# EAGLE design SOIC-24 (EAGLE 5.00)
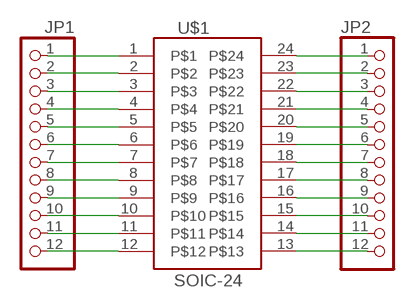
[diagram p0: schematic, sheet 1]

## Parts
JP1  PINHD-1X12  [1X12]
JP2  PINHD-1X12  [1X12]
U$1  SOIC-24  [SOIC-24]

## Nets
N$1: JP1.1 U$1.1
N$2: JP1.2 U$1.2
N$3: JP1.3 U$1.3
N$4: JP1.4 U$1.4
N$5: JP1.5 U$1.5
N$6: JP1.6 U$1.6
N$7: JP1.7 U$1.7
N$8: JP1.8 U$1.8
N$9: JP1.9 U$1.9
N$10: JP1.10 U$1.10
N$11: JP1.11 U$1.11
N$12: JP1.12 U$1.12
N$13: JP2.1 U$1.24
N$14: JP2.2 U$1.23
N$15: JP2.3 U$1.22
N$16: JP2.4 U$1.21
N$17: JP2.5 U$1.20
N$18: JP2.6 U$1.19
N$19: JP2.7 U$1.18
N$20: JP2.8 U$1.17
N$21: JP2.9 U$1.16
N$22: JP2.10 U$1.15
N$23: JP2.11 U$1.14
N$24: JP2.12 U$1.13

## Library data of the parts
JP1 JP2 = pinhead:PINHD-1X12: PIN HEADER
U$1 = smd:SOIC-24

## Board
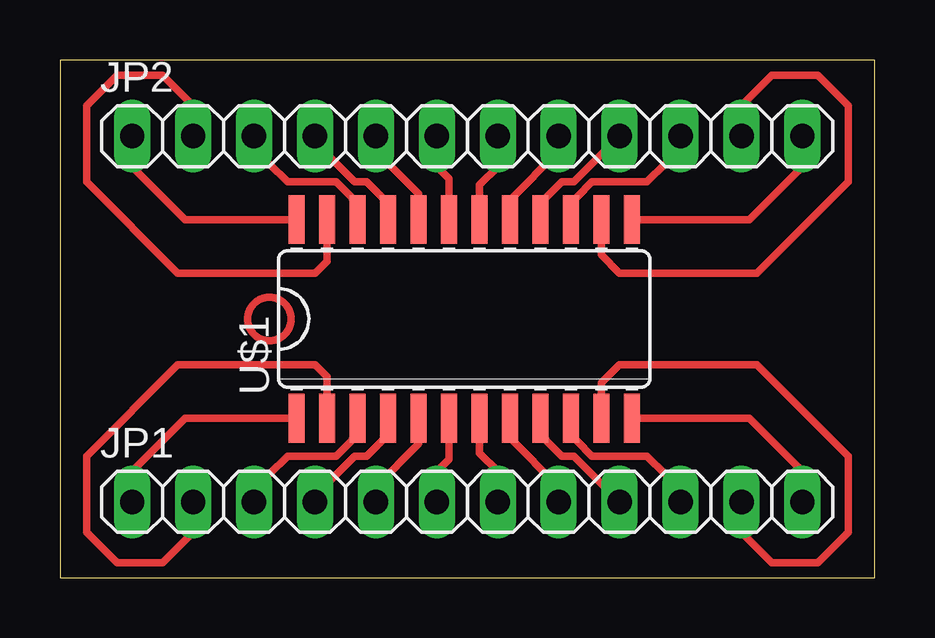
[diagram p1: board, top side]

Size 33.96 x 21.58 mm. Coordinates in mm from the lower left corner, seen from the top.
Outline: 0,0 33.96,0 33.96,21.58 0,21.58 0,0
Copper layers (1*16): Top 0.035mm / dielectric 1.5mm / Bottom 0.035mm
Design rules "default": minimum track width 10mil, minimum drill 24mil, track to track 8mil, track to pad 8mil, pad to pad 8mil, via to via 8mil, smd to smd 8mil, copper to edge 40mil, drill to drill 8mil, minimum pad ring 10mil, minimum via ring 8mil, stop-mask expansion 4mil, vias tented up to drill 0mil, thermal gap 10mil

### Footprints (pad centres in the part's own frame; a part is rotated, then mirrored left to right if it is on the bottom)
1X12 = drill 1.016 long: 1 -13.97,0; 2 -11.43,0; 3 -8.89,0; 4 -6.35,0; 5 -3.81,0; 6 -1.27,0; 7 1.27,0; 8 3.81,0; 9 6.35,0; 10 8.89,0; 11 11.43,0; 12 13.97,0
SOIC-24 = smd 0.66 x 2.032: 1 -6.985,-4.14; 2 -5.715,-4.14; 3 -4.445,-4.14; 4 -3.175,-4.14; 5 -1.905,-4.14; 6 -0.635,-4.14; 7 0.635,-4.14; 8 1.905,-4.14; 9 3.175,-4.14; 10 4.445,-4.14; 11 5.715,-4.14; 12 6.985,-4.14; 13 6.985,4.14; 14 5.715,4.14; 15 4.445,4.14; 16 3.175,4.14; 17 1.905,4.14; 18 0.635,4.14; 19 -0.635,4.14; 20 -1.905,4.14; 21 -3.175,4.14; 22 -4.445,4.14; 23 -5.715,4.14; 24 -6.985,4.14

### Placement (x,y rotation side)
JP1  16.98,3.17 0 top
JP2  16.98,18.41 0 top
U$1  16.85,10.79 0 top

### Tracks (layer width: path | path; a pad name or v marks a point on that pad's centre or on a via)
N$1
  Top 0.305: U$1.1 5.22,6.65 3.01,4.44 JP1.1
N$2
  Top 0.305: U$1.2 11.14,8.38 10.63,8.89 4.92,8.89 1.1,5.08 1.1,1.9 2.38,0.63 4.28,0.63 5.55,1.9 JP1.2
N$3
  Top 0.254: 12.15,5.71 U$1.3
  Top 0.305: 12.15,5.71 11.52,5.08 9.49,5.08 8.73,4.31 JP1.3
N$4
  Top 0.254: 13.42,5.71 U$1.4
  Top 0.305: 13.42,5.71 12.79,5.08 12.28,5.08 11.27,4.06 JP1.4
N$5
  Top 0.305: U$1.5 14.95,5.58 13.17,3.8 JP1.5
N$6
  Top 0.305: U$1.6 16.22,4.95 15.71,4.44 JP1.6
N$7
  Top 0.305: U$1.7 17.49,5.2 18.25,4.44 JP1.7
N$8
  Top 0.305: 18.76,5.84 20.79,3.8 JP1.8
  Top 0.406: U$1.8 18.76,5.84
N$9
  Top 0.254: U$1.9 20.28,5.71
  Top 0.305: 20.28,5.71 20.92,5.08 21.42,5.08 JP1.9
N$10
  Top 0.254: 21.55,5.71 U$1.10
  Top 0.305: 21.55,5.71 22.19,5.08 24.47,5.08 25.23,4.31 JP1.10
N$11
  Top 0.305: U$1.11 22.57,8.12 23.33,8.89 29.04,8.89 32.85,5.08 32.85,1.9 31.58,0.63 29.68,0.63 28.41,1.9 JP1.11
N$12
  Top 0.305: U$1.12 28.74,6.65 30.95,4.44 JP1.12
N$13
  Top 0.305: U$1.24 5.22,14.93 3.01,17.14 JP2.1
N$14
  Top 0.305: U$1.23 11.14,13.2 10.63,12.7 4.92,12.7 1.1,16.5 1.1,19.68 2.38,20.95 4.28,20.95 5.55,19.68 JP2.2
N$15
  Top 0.254: U$1.22 12.15,15.87
  Top 0.305: 12.15,15.87 11.52,16.5 9.49,16.5 8.73,17.27 JP2.3
N$16
  Top 0.254: U$1.21 13.42,15.87
  Top 0.305: 13.42,15.87 12.79,16.5 12.28,16.5 11.27,17.52 JP2.4
N$17
  Top 0.305: U$1.20 14.95,16 13.17,17.77 JP2.5
N$18
  Top 0.305: U$1.19 16.22,16.63 15.71,17.14 JP2.6
N$19
  Top 0.305: U$1.18 17.49,16.38 18.25,17.14 JP2.7
N$20
  Top 0.305: U$1.17 18.76,15.74 20.79,17.77 JP2.8
N$21
  Top 0.254: U$1.16 20.28,15.87
  Top 0.305: 20.28,15.87 20.92,16.5 21.42,16.5 JP2.9
N$22
  Top 0.254: U$1.15 21.55,15.87
  Top 0.305: 21.55,15.87 22.19,16.5 24.47,16.5 25.23,17.27 JP2.10
N$23
  Top 0.305: U$1.14 22.57,13.46 23.33,12.7 29.04,12.7 32.85,16.5 32.85,19.68 31.58,20.95 29.68,20.95 28.41,19.68
  Top 0.406: 28.41,19.68 JP2.11
N$24
  Top 0.305: U$1.13 28.74,14.93 30.95,17.14 JP2.12
(copper drawn outside any net)
  shapes: Top circle x1